# EAGLE design current-meter-nrf (EAGLE 6.3)
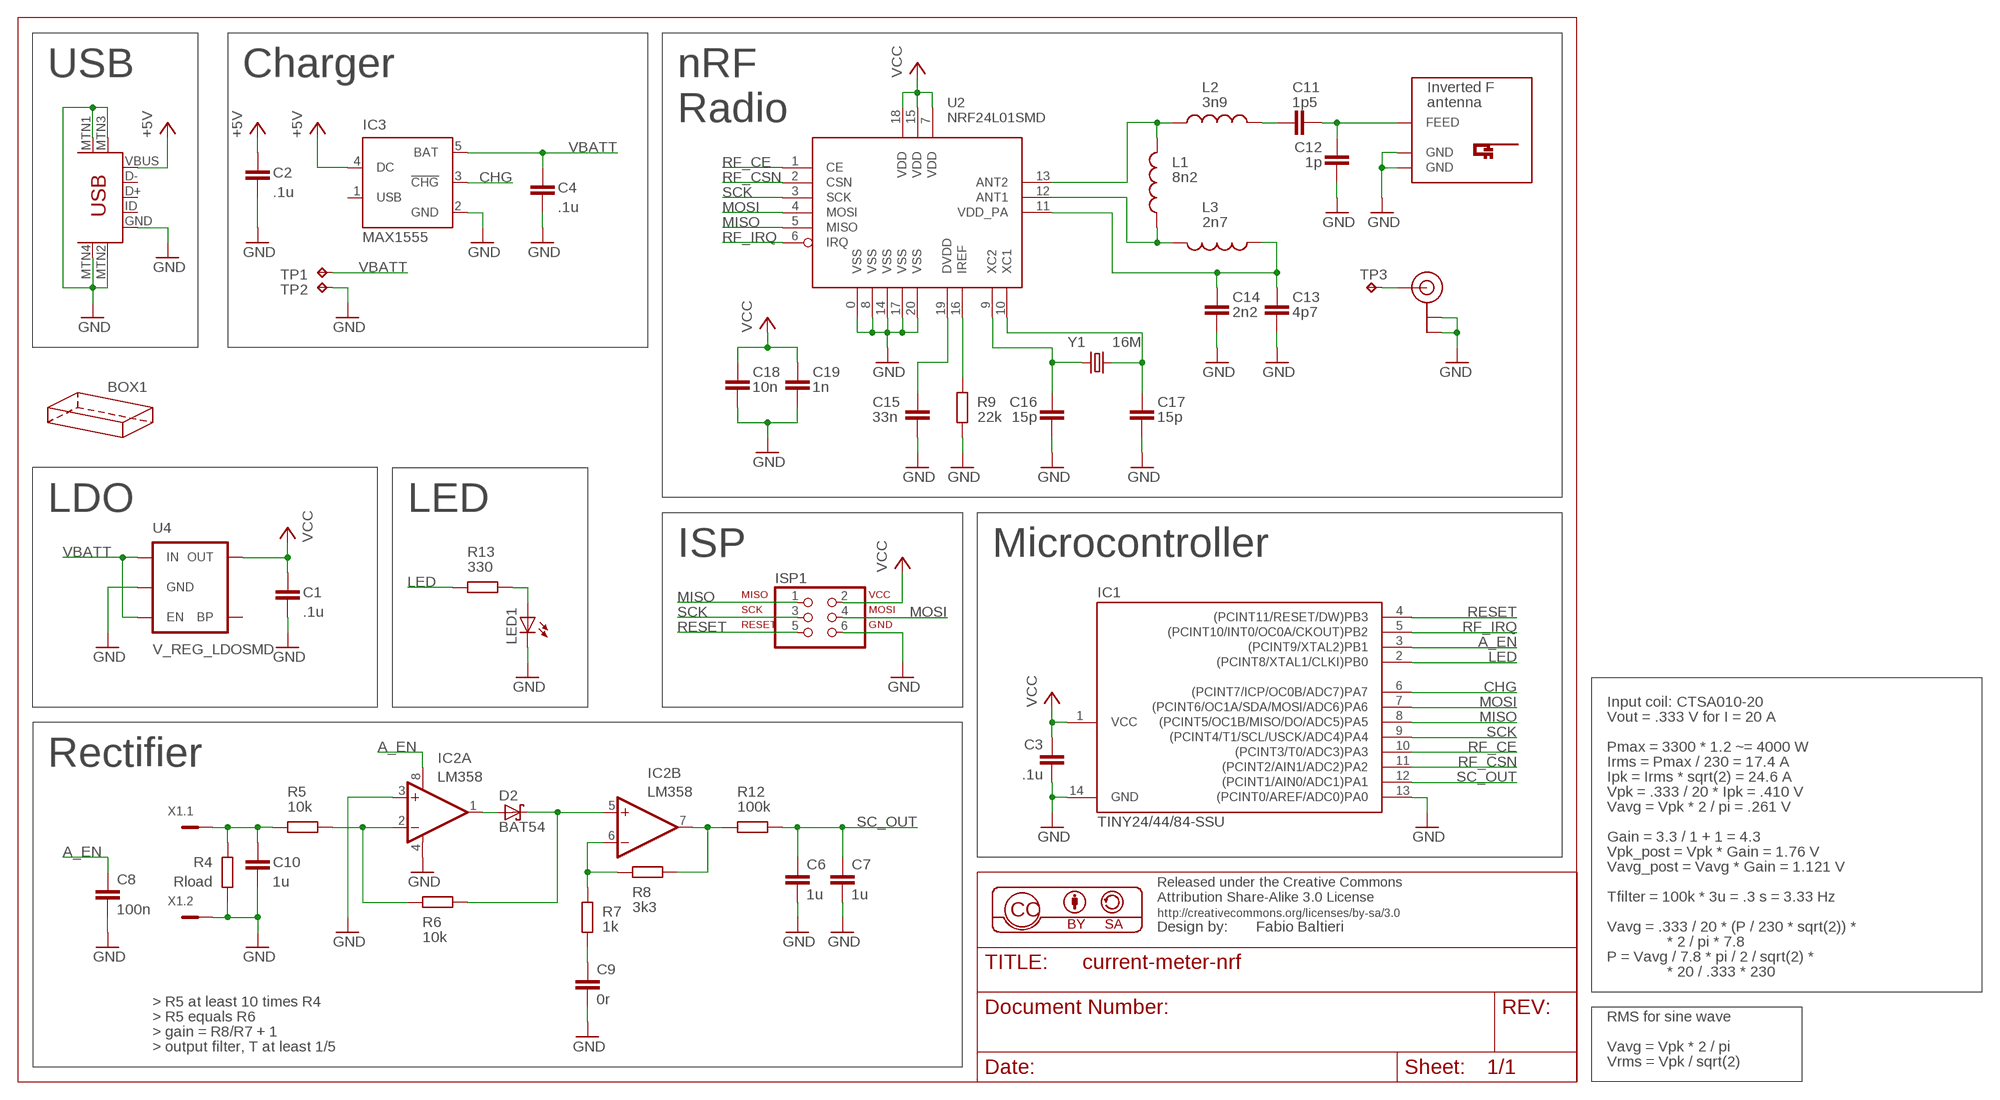
[diagram p0: schematic, sheet 1]

## Parts
BOX1  HAMMOND-BOX-G-1H  [1551G-1HOLE]
C1  .1u  C-EUC0805  [C0805]
C2  .1u  C-EUC0805  [C0805]
C3  .1u  C-EUC0805  [C0805]
C4  .1u  C-EUC0805  [C0805]
C6  1u  C-EUC0805  [C0805]
C7  1u  C-EUC0805  [C0805]
C8  100n  C-EUC0805  [C0805]
C9  0r  C-EUC0805  [C0805]
C10  1u  C-EUC0805  [C0805]
C11  1p5  C-EUC0603  [C0603]
C12  1p  C-EUC0603  [C0603]
C13  4p7  C-EUC0603  [C0603]
C14  2n2  C-EUC0603  [C0603]
C15  33n  C-EUC0603  [C0603]
C16  15p  C-EUC0603  [C0603]
C17  15p  C-EUC0603  [C0603]
C18  10n  C-EUC0603  [C0603]
C19  1n  C-EUC0603  [C0603]
D2  BAT54  [SOT23]
IC1  TINY24/44/84-SSU  [SOIC14]
IC2  LM358  OPA2234U  [SO08]
IC3  MAX1555  [SOT23-5L]
ISP1  ISP-AVR910PTH  [2X03]
L1  8n2  INDUCTOR0603  [0603]
L2  3n9  INDUCTOR0603  [0603]
L3  2n7  INDUCTOR0603  [0603]
LED1  LEDSML0805  [SML0805]
R4  Rload  R-EU_R0805  [R0805]
R5  10k  R-EU_R0603  [R0603]
R6  10k  R-EU_R0603  [R0603]
R7  1k  R-EU_R0603  [R0603]
R8  3k3  R-EU_R0603  [R0603]
R9  22k  R-EU_R0603  [R0603]
R12  100k  R-EU_R0603  [R0603]
R13  330  R-EU_R0603  [R0603]
TP1  TPTP12R  [TP12R]
TP2  TPTP12R  [TP12R]
TP3  TPTP08SQ  [TP08SQ]
U2  NRF24L01SMD  [QFN20]
U3  USB-MINIB-5PIN  [USB-MINIB]
U4  V_REG_LDOSMD  [SOT23-5]
U$1  INVERTED_F_ANTENNA+5  [DN007+5]
U$2  U.FL  [U.FL]
X1  MC2  [MC2]
Y1  16M  CRYSTAL5X3  [CRYSTAL-SMD-5X3]

## Nets
+5V: C2.1 IC3.4(DC) U3.VBUS
A_EN: C8.1 IC1.3((PCINT9/XTAL2)PB1) IC2.8(A:V+)
CHG: IC1.6((PCINT7/ICP/OC0B/ADC7)PA7) IC3.3(!CHG)
GND: C1.2 C2.2 C3.2 C4.2 C6.2 C7.2 C8.2 C9.2 C10.2 C12.2 C13.2 C14.2 C15.2 C16.2 C17.2 C18.2 C19.2 IC1.13((PCINT0/AREF/ADC0)PA0) IC1.14(GND) IC2.3(A:+IN) IC2.4(A:V-) IC3.2(GND) ISP1.6 LED1.C R4.1 R9.2 TP2.TP U2.0(VSS) U2.8(VSS) U2.14(VSS) U2.17(VSS) U2.20(VSS) U3.GND U3.MTN1(MTN2) U3.MTN2(MTN3) U3.MTN3(MTN1) U3.MTN4 U4.2(GND) U$1.GND U$1.GND@1(GND) U$2.P$1(GND) U$2.P$2(GND) X1.2
LED: IC1.2((PCINT8/XTAL1/CLKI)PB0) R13.2
MISO: IC1.8((PCINT5/OC1B/MISO/DO/ADC5)PA5) ISP1.1 U2.5(MISO)
MOSI: IC1.7((PCINT6/OC1A/SDA/MOSI/ADC6)PA6) ISP1.4 U2.4(MOSI)
N$3: LED1.A R13.1
N$4: C9.1 R7.1
N$5: L1.2 L3.2 U2.12(ANT1)
N$6: L1.1 L2.1 U2.13(ANT2)
N$7: IC2.2(A:-IN) R5.2 R6.1
N$8: D2.1(A) IC2.1(A:OUT)
N$9: D2.3(C) IC2.5(B:+IN) R6.2
N$10: C11.1 L2.2
N$11: IC2.6(B:-IN) R7.2 R8.1
N$12: IC2.7(B:OUT) R8.2 R12.1
N$13: C11.2 C12.1 U$1.FEED
N$14: C13.1 C14.1 L3.1 U2.11(VDD_PA)
N$15: C15.1 U2.19(DVDD)
N$16: R9.1 U2.16(IREF)
N$17: C17.1 U2.10(XC1) Y1.3
N$18: C16.1 U2.9(XC2) Y1.1
N$19: TP3.TP U$2.P$3(SIGNAL)
RESET: IC1.4((PCINT11/RESET/DW)PB3) ISP1.5
RF_CE: IC1.10((PCINT3/T0/ADC3)PA3) U2.1(CE)
RF_CSN: IC1.11((PCINT2/AIN1/ADC2)PA2) U2.2(CSN)
RF_IRQ: IC1.5((PCINT10/INT0/OC0A/CKOUT)PB2) U2.6(IRQ)
SC_IN_A: C10.1 R4.2 R5.1 X1.1
SC_OUT: C6.1 C7.1 IC1.12((PCINT1/AIN0/ADC1)PA1) R12.2
SCK: IC1.9((PCINT4/T1/SCL/USCK/ADC4)PA4) ISP1.3 U2.3(SCK)
VBATT: C4.1 IC3.5(BAT) TP1.TP U4.1(IN) U4.3(EN)
VCC: C1.1 C3.1 C18.1 C19.1 IC1.1(VCC) ISP1.2 U2.7(VDD) U2.15(VDD) U2.18(VDD) U4.5(OUT)
Unconnected: IC3.1(USB) U3.D+ U3.D- U3.ID U4.4(BP)

## Notes on the sheet
- USB | Charger | nRF
- Radio
- LDO | LED
- ISP | Microcontroller
- Input coil: CTSA010-20
- Vout = .333 V for I = 20 A
- Pmax = 3300 * 1.2 ~= 4000 W
- Rectifier | Irms = Pmax / 230 = 17.4 A
- Ipk = Irms * sqrt(2) = 24.6 A
- Vpk = .333 / 20 * Ipk = .410 V
- Vavg = Vpk * 2 / pi = .261 V
- Gain = 3.3 / 1 + 1 = 4.3
- Vpk_post = Vpk * Gain = 1.76 V
- Vavg_post = Vavg * Gain = 1.121 V
- Tfilter = 100k * 3u = .3 s = 3.33 Hz
- Vavg = .333 / 20 * (P / 230 * sqrt(2)) *
- * 2 / pi * 7.8
- P = Vavg / 7.8 * pi / 2 / sqrt(2) *
- * 20 / .333 * 230
- > R5 at least 10 times R4
- > R5 equals R6 | RMS for sine wave
- > gain = R8/R7 + 1
- > output filter, T at least 1/5 | Vavg = Vpk * 2 / pi
- Vrms = Vpk / sqrt(2)

## Library data of the parts
BOX1 = hammond:HAMMOND-BOX: Hammond Project boxes Hammond 1551 Transluscent Blue 50x35x20mm 1551GTBU http://www.hammondmfg.com/pdf/1551G.pdf Hammond 1551 Transluscent Blue 50x50x20mm 1551RTBU http://www.hammondmfg.com/pdf/1551R.pdf Hammond 1551 Transluscent Blue 60x35x20mm 1551HTBU http://www.hammondmfg.com/pdf/1551H.pdf Hammond 1551 Transluscent Blue 80x40x20mm 1551KTBU http://www.hammondmfg.com/pdf/1551K.pdf Hammond 1591 Transluscent Blue 100x51x22m m 1591XXATBU http://www.hammondmfg.com/pdf/1591XXA.pdf
C1-C4 C6-C19 = rcl:C-EU: CAPACITOR, European symbol
D2 = diode:BAT54: Schottky Diodes Source: Fairchild .. BAT54.pdf
IC1 = avr-5:TINY24/44/84
IC2 = burr-brown:OPA2234: Operational Amplifier; MF: TEXAS INSTRUMENTS; MPN: OPA2234U; OC_FARNELL: 1212441; OC_NEWARK: 96K4523
IC3 = maxim:MAX1555: Dual-Input USB/AC Adapter 1-Cell Li+ Battery Chargers Source: http://www.maxim-ic.com .. MAX1551-MAX1555.pdf
ISP1 = balto:ISP-AVR910: PIN HEADER
L1-L3 = SparkFun:INDUCTOR: Inductors Basic Inductor/Choke - 0603 and 1206. Footprints are not proven and vary greatly between part numbers.
LED1 = led:LED: LED OSRAM: - CHIPLED LG R971, LG N971, LY N971, LG Q971, LY Q971, LO R971, LY R971 LH N974, LH R974 LS Q976, LO Q976, LY Q976 LO Q996 - Hyper CHIPLED LW Q18S LB Q993, LB Q99A, LB R99A - SideLED LS A670, LO A670, LY A670, LG A670, LP A670 LB A673, LV A673, LT A673, LW A673 LH A674 LY A675 LS A676, LA A676, LO A676, LY A676, LW A676 LS A679, LY A679, LG A679 - Hyper Micro SIDELED® LS Y876, LA Y876, LO Y876, LY Y876 LT Y87S - SmartLED LW L88C, LW L88S LB L89C, LB L89S, LG L890 LS L89K, LO L89K, LY L89K LS L896, LA L896, LO L896, LY L896 - TOPLED LS T670, LO T670, LY T670, LG T670, LP T670 LSG T670, LSP T670, LSY T670, LOP T670, LYG T670 LG T671, LOG T671, LSG T671 LB T673, LV T673, LT T673, LW T673 LH T674 LS T676, LA T676, LO T676, LY T676, LB T676, LH T676, LSB T676, LW T676 LB T67C, LV T67C, LT T67C, LS T67K, LO T67K, LY T67K, LW E67C LS E67B, LA E67B, LO E67B, LY E67B, LB E67C, LV E67C, LT E67C LW T67C LS T679, LY T679, LG T679 LS T770, LO T770, LY T770, LG T770, LP T770 LB T773, LV T773, LT T773, LW T773 LH T774 LS E675, LA E675, LY E675, LS T675 LS T776, LA T776, LO T776, LY T776, LB T776 LHGB T686 LT T68C, LB T68C - Hyper Mini TOPLED® LB M676 - Mini TOPLED Santana® LG M470 LS M47K, LO M47K, LY M47K Source: http://www.osram.convergy.de LUXEON: - LUMILED® LXK2-PW12-R00, LXK2-PW12-S00, LXK2-PW14-U00, LXK2-PW14-V00 LXK2-PM12-R00, LXK2-PM12-S00, LXK2-PM14-U00 LXK2-PE12-Q00, LXK2-PE12-R00, LXK2-PE12-S00, LXK2-PE14-T00, LXK2-PE14-U00 LXK2-PB12-K00, LXK2-PB12-L00, LXK2-PB12-M00, LXK2-PB14-N00, LXK2-PB14-P00, LXK2-PB14-Q00 LXK2-PR12-L00, LXK2-PR12-M00, LXK2-PR14-Q00, LXK2-PR14-R00 LXK2-PD12-Q00, LXK2-PD12-R00, LXK2-PD12-S00 LXK2-PH12-R00, LXK2-PH12-S00 LXK2-PL12-P00, LXK2-PL12-Q00, LXK2-PL12-R00 Source: www.luxeon.com KINGBRIGHT: KA-3528ASYC Source: www.kingbright.com
R4-R9 R12 R13 = rcl:R-EU_: RESISTOR, European symbol
TP1-TP3 = testpad:TP: Test pad
U2 = SparkFun:NRF24L01: 2.4GHz Low Power Transceiver This is the very popular, low cost, very low power RF transceiver from Nordic Semiconductor. Simple SPI interface. SKU: COM-00690
U3 = SparkFun:USB-MINIB: Mini-USB "B" connector with 5th pin broken out. Created new symbol breaking out 5th "ID" pin in mini/micro USB connector spec. See: http://en.wikipedia.org/wiki/Mini_usb#Cables. Uses same footprint as 4-pin symbol. Also added pins to connect to mounting / shield pads if required (probably not generally needed as signals aren't shielded once they leave the connector).
U4 = SparkFun-PowerIC:V_REG_LDO: Voltage Regulator LDO Standard 150mA LDO voltage regulator in SOT-23 layout. Micrel part MIC5205. BP (by-pass) pin is used to lower output noise with 470pF cap.
U$1 = antenna:INVERTED_F_ANTENNA: 2.4GHz Inverted F Antenna Based on TI Design Note DN007
U$2 = SparkFun-Connectors:U.FL: SMD antenna connector- WRL-09144
X1 = con-phoenix-381_l:MC2: Mini-Combicon 3.81mm horizontal 2-polig MC 1,5/2-G-3,81 Artikel-Nr. 1803277
Y1 = SparkFun:CRYSTAL: Crystals Various standard crystals. Proven footprints. Spark Fun Electronics SKU : COM-00534

## Net classes
1 power: width 0.254 mm

## Board
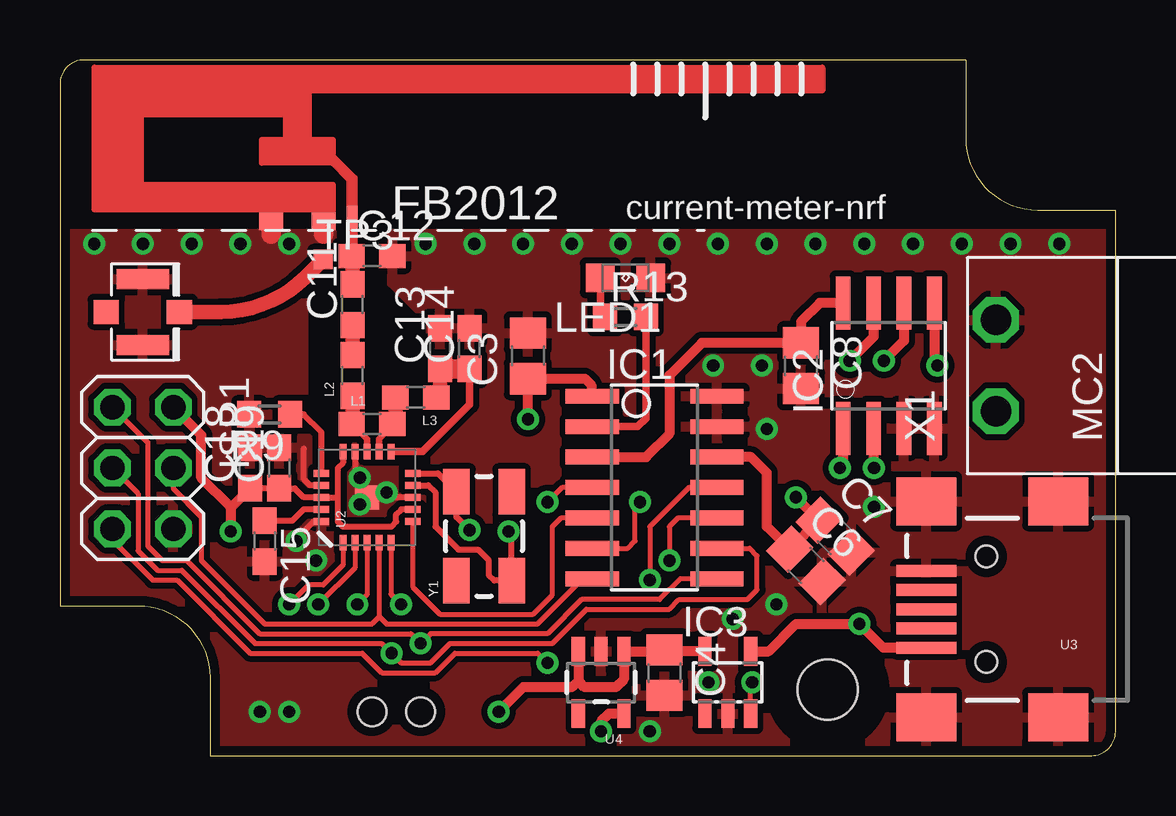
[diagram p1: board, top side]
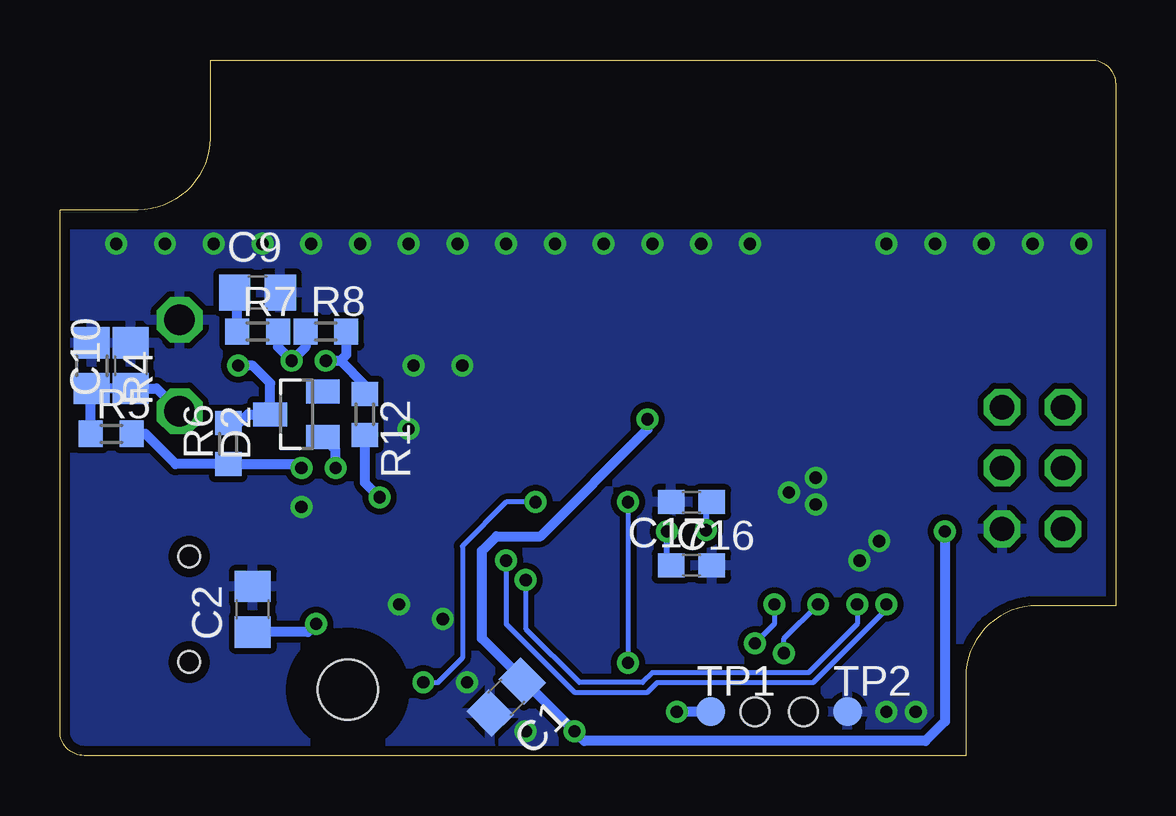
[diagram p2: board, bottom side, seen from below]

Size 44 x 29 mm. Coordinates in mm from the lower left corner, seen from the top.
Copper layers (1*16): Top 0.035mm / dielectric 1.5mm / Bottom 0.035mm
Design rules "default": minimum track width 8mil, minimum drill 20mil, track to track 8mil, track to pad 8mil, pad to pad 8mil, via to via 8mil, smd to smd 8mil, copper to edge 16mil, drill to drill 8mil, minimum pad ring 8mil, minimum via ring 8mil, stop-mask expansion 4mil, vias tented up to drill 20mil, thermal gap 10mil
Holes 1.2 mm at 13,1.83 15.04,1.83

### Footprints (pad centres in the part's own frame; a part is rotated, then mirrored left to right if it is on the bottom)
1551G-1HOLE = hole 2.5: 12,26.25
C0805 = smd 1.3 x 1.5: 1 -0.95,0; 2 0.95,0
C0603 = smd 1.1 x 1: 1 -0.85,0; 2 0.85,0
SOT23 = smd 1 x 1.4: 1 -0.95,-1.1; 2 0.95,-1.1; 3 0,1.1
SOIC14 = smd 0.61 x 2.21: 1 -3.81,-2.603; 2 -2.54,-2.603; 3 -1.27,-2.603; 4 0,-2.603; 5 1.27,-2.603; 6 2.54,-2.603; 7 3.81,-2.603; 8 3.81,2.603; 9 2.54,2.603; 10 1.27,2.603; 11 0,2.603; 12 -1.27,2.603; 13 -2.54,2.603; 14 -3.81,2.603
SO08 = smd 0.61 x 2.21: 1 -1.905,-2.616; 2 -0.635,-2.616; 3 0.635,-2.616; 4 1.905,-2.616; 5 1.905,2.616; 6 0.635,2.616; 7 -0.635,2.616; 8 -1.905,2.616
SOT23-5L = smd 0.55 x 1.2: 1 -0.95,-1.3; 2 0,-1.3; 3 0.95,-1.3; 4 0.95,1.3; 5 -0.95,1.3
2X03 = drill 1.016 octagon: 1 -2.54,-1.27; 2 -2.54,1.27; 3 0,-1.27; 4 0,1.27; 5 2.54,-1.27; 6 2.54,1.27
0603 = smd 1.1 x 1: 1 -0.85,0; 2 0.85,0
SML0805 = smd 1.2 x 1.2: A 1.05,0; C -1.05,0
R0805 = smd 1.3 x 1.5: 1 -0.95,0; 2 0.95,0
R0603 = smd 1 x 1.1: 1 -0.85,0; 2 0.85,0
TP12R = smd 1.2 x 1.2: TP 0,0
TP08SQ = smd 0.8 x 0.8: TP 0,0
QFN20 = smd 1 x 1: 0 0,0 | smd 0.65 x 0.29: 1 -1.9,1; 2 -1.9,0.5; 3 -1.9,0; 4 -1.9,-0.5; 5 -1.9,-1; 11 1.9,-1; 12 1.9,-0.5; 13 1.9,0; 14 1.9,0.5; 15 1.9,1 | smd 0.29 x 0.65: 6 -1,-1.9; 7 -0.5,-1.9; 8 0,-1.9; 9 0.5,-1.9; 10 1,-1.9; 16 1,1.9; 17 0.5,1.9; 18 0,1.9; 19 -0.5,1.9; 20 -1,1.9
USB-MINIB = smd 2.5 x 0.5: D+ 2.5,0; D- 2.5,0.8; GND 2.5,-1.6; ID 2.5,-0.8; VBUS 2.5,1.6 | smd 2.5 x 2: MTN1 -3,4.5; MTN2 2.5,4.5; MTN3 -3,-4.5; MTN4 2.5,-4.5 | hole 0.9: 0,2.2; 0,-2.2
SOT23-5 = smd 0.55 x 1.2: 1 -0.95,-1.3; 2 0,-1.3; 3 0.95,-1.3; 4 0.95,1.3; 5 -0.95,1.3
DN007+5 = smd 0.46 x 1: FEED 2.22,-2.8 | smd 1.01 x 0.74: GND -1.16,-2.93; GND@1 1.035,-2.93
U.FL = smd 2.2 x 0.85: P$1 0,1.375; P$2 0,-1.375 | smd 1.05 x 1: P$3 1.525,0; P$4 -1.525,0
MC2 = drill 1.27 octagon: 1 -1.905,0; 2 1.905,0
CRYSTAL-SMD-5X3 = smd 1.9 x 1.1: 1 -1.85,-1.15; 2 1.85,-1.15; 3 1.85,1.15; 4 -1.85,1.15

### Placement (x,y rotation side)
BOX1  44,29 180 top
C1  25.4,2.44 225 bottom
C2  35.97,6.1 90 bottom
C3  19.51,16.66 90 top
C4  25.2,3.45 270 top
C6  31.09,7.92 315 top
C7  32.31,9.14 315 top
C8  30.89,16.26 270 top
C9  35.76,19.3 0 bottom
C10  41.05,16.26 90 bottom
C11  12.19,18.8 90 top
C12  13,20.83 0 top
C13  15.85,16.97 90 top
C14  17.07,16.97 90 top
C15  8.53,8.94 270 top
C16  17.68,7.92 0 bottom
C17  17.68,10.57 180 bottom
C18  7.92,11.99 90 top
C19  9.14,11.99 90 top
D2  34.14,14.22 90 bottom
IC1  24.79,11.18 270 top
IC2  34.54,16.26 0 top
IC3  27.84,3.05 0 top
ISP1  3.45,11.99 270 top
L1  13,13.82 0 top
L2  12.19,15.85 90 top
L3  14.83,14.94 180 top
LED1  23.57,19.91 180 top
R4  42.67,16.26 270 bottom
R5  41.86,13.41 0 bottom
R6  36.98,13 90 bottom
R7  35.76,17.68 0 bottom
R8  32.92,17.68 0 bottom
R9  8.74,14.22 180 top
R12  31.29,14.22 270 bottom
R13  23.57,18.29 0 top
TP1  16.87,1.83 0 bottom
TP2  11.18,1.83 0 bottom
TP3  10.97,20.69 0 top
U2  12.8,10.77 90 top
U3  38.61,6.1 180 top
U4  22.56,3.05 180 top
U$1  9.96,25.2 0 top
U$2  3.45,18.49 0 top
X1  39.01,16.26 90 top
Y1  17.68,9.14 90 top

### Tracks (layer width: path | path; a pad name or v marks a point on that pad's centre or on a via)
+5V  (via drill 0.51)
  Top 0.406: U3.VBUS 34.31,4.5 v33.33,5.49 30.68,5.49 29.55,4.35 IC3.4
  Bottom 0.406: v33.33,5.49 33.66,5.15 C2.1
A_EN
  Top 0.406: IC2.8 31.67,18.87 30.89,18.09 C8.1 26.76,17.21 25.4,15.85 25.4,13.41 24.43,12.45 IC1.3
CHG  (via drill 0.51)
  Top 0.203: IC3.3 28.79,2.98 v28.85,3.05 | IC1.6 23.67,8.64 23.98,8.94 23.98,10.36 v24.18,10.57
  Bottom 0.203: v24.18,10.57 25.4,10.57 27.23,8.74 27.23,4.06 28.25,3.05 v28.85,3.05
GND  (via drill 0.51)
  Top 0.254: U2.14 12.3,11.79 | U2.8 13.61,10.77 | U2.17 10.42,11.27 10.16,11.53 10.16,12.8 | U2.20 10.58,9.77 9.96,9.14
  Top 0.813: U$1.GND 8.8,21.74 | U$1.GND@1 10.99,21.74
  other vias: 17.27,21.34 15.24,21.34 19.3,21.34 21.34,21.34 23.37,21.34 25.4,21.34 27.43,21.34 29.46,21.34 31.5,21.34 33.53,21.34 35.56,21.34 37.59,21.34 39.62,21.34 41.66,21.34 7.52,21.34 5.49,21.34 3.45,21.34 1.42,21.34 12.5,10.46 12.5,11.58 13.61,10.97 9.55,21.34 9.86,8.94 10.67,8.13 27.23,16.26 29.26,16.26 29.46,13.61 29.87,6.3 33.93,10.36 28.04,5.69 8.33,1.83 9.55,1.83 27.03,3.05 24.59,1.02
  pour Top (isolate 0.254): 0,0 44.09,0 44.09,21.74 13.82,21.74 13.82,19.71 15.44,18.08 15.44,13.41 10.16,13.41 10.16,21.13 11.38,21.13 11.38,21.74 0,21.74
  pour Bottom (isolate 0.254): 0,0 44.09,0 44.09,21.74 0,21.74
  pour Top (isolate 0.254, no thermals): 11.99,9.96 13.41,9.96 13.82,10.36 13.82,11.79 12.19,11.79 11.99,11.58
LED
  Top 0.305: IC1.2 24.08,13.72 24.42,14.06 R13.2
MISO  (via drill 0.51)
  Top 0.203: ISP1.1 3.66,13.06 3.66,8.74 4.27,8.13 5.28,8.13 8.33,5.08 14.63,5.08 v15.04,4.67 15.44,5.08 20.32,5.08 21.74,6.5 24.99,6.5 25.86,7.37 IC1.8 | U2.5 13.8,6.72 v14.22,6.3
  Bottom 0.203: v14.22,6.3 14.22,5.49 v15.04,4.67
MOSI
  Top 0.203: ISP1.4 4.72,11.12 5.89,9.96 5.89,8.13 8.53,5.49 13.01,5.49 13.3,5.78 | U2.4 13.3,5.78 | 13.3,5.78 13.32,5.78 13.61,5.49 19.9,5.49 21.78,7.37 IC1.7
N$3
  Top 0.305: R13.1 22.52,18.49 LED1.A
N$4
  Bottom 0.406: R7.1 36.61,19.2 C9.1
N$5
  Top 0.279: U2.12 13.3,13.21 13.86,13.76 L1.2
  Top 0.61: L3.2 13.98,13.95 L1.2
N$6
  Top 0.279: U2.13 12.8,13.21 12.19,13.82 L1.1
  Top 0.61: L2.1 12.19,13.86 L1.1
N$7  (via drill 0.51)
  Top 0.406: IC2.2 33.91,12.01 v33.93,11.99
  Bottom 0.406: R5.2 40.44,13.41 39.18,12.15 R6.1 34.1,12.15 v33.93,11.99
N$8  (via drill 0.51)
  Top 0.406: IC2.1 32.64,12.12 v32.51,11.99
  Bottom 0.406: v32.51,11.99 32.51,12.75 D2.1
N$9  (via drill 0.51)
  Top 0.406: IC2.5 36.45,16.38 v36.58,16.26
  Bottom 0.406: R6.2 36.54,13.86 36.17,14.22 D2.3 35.24,15.53 35.97,16.26 v36.58,16.26
N$10
  Top 0.61: C11.1 L2.2
N$11  (via drill 0.51)
  Top 0.406: IC2.6 35.18,17.3 v34.34,16.46
  Bottom 0.406: R8.1 33.77,17.03 v34.34,16.46 34.91,17.03 R7.2
N$12  (via drill 0.51)
  Top 0.406: IC2.7 33.91,17.45 v32.92,16.46
  Bottom 0.406: v32.92,16.46 32.31,16.46 | 32.31,16.46 32.07,16.7 R8.2 | 32.31,16.46 31.29,15.44 R12.1
N$13
  Top 0.46: U$1.FEED 12.18,20.85 C12.1
  Top 0.61: C11.2 12.19,20.79 C12.1
N$14
  Top 0.305: U2.11 15.11,12.67 17.07,14.63 C14.1
  Top 0.61: C13.1 15.85,15.1 L3.1
  Top 0.813: C14.1 C13.1
N$15
  Top 0.254: U2.19 10.16,10.27 9.68,9.79 C15.1
N$16
  Top 0.254: U2.16 10.9,13.48 10.16,14.22 R9.1
N$17  (via drill 0.51)
  Top 0.254: U2.10 15.75,11.77 Y1.3 16.53,9.94 v17.07,9.4
  Bottom 0.254: C17.1 17.07,10.33 v17.07,9.4
N$18  (via drill 0.51)
  Top 0.254: U2.9 15.35,11.27 15.65,10.97 15.65,9.55 16.61,8.59 17.42,8.59 17.88,8.13 17.88,7.52 18.11,7.29 Y1.1 18.83,9.21 v18.69,9.35
  Bottom 0.254: C16.1 18.69,8.09 v18.69,9.35
N$19
  Top 0.61: U$2.P$3 6.7,18.49 arc45 10.23,19.96 TP3.TP
RESET  (via drill 0.51)
  Top 0.203: ISP1.5 2.18,8.99 3.86,7.32 4.88,7.32 7.92,4.27 12.6,4.27 13.41,3.45 15.65,3.45 16.46,4.27 19.91,4.27 v20.32,3.86 | IC1.4 20.93,11.18 v20.32,10.57
  Bottom 0.203: v20.32,10.57 v20.32,3.86
RF_CE  (via drill 0.51)
  Top 0.203: U2.1 11.8,7.94 10.97,7.11 10.36,7.11 v9.55,6.3 | IC1.10 25.76,9.91 25.4,9.55 v25.4,8.13
  Bottom 0.203: v25.4,8.13 25.4,5.49 22.55,2.64 19.51,2.64 19.1,3.05 12.6,3.05 9.55,6.1 v9.55,6.3
RF_CSN  (via drill 0.51)
  Top 0.203: U2.2 12.3,7.83 v10.77,6.3 | IC1.11 26.21,11.18 24.59,9.55 v24.59,7.32
  Bottom 0.203: v24.59,7.32 24.59,5.28 22.35,3.05 19.71,3.05 19.3,3.45 12.8,3.45 10.77,5.49 v10.77,6.3
RF_IRQ
  Top 0.203: U2.6 14.7,7.04 15.85,5.89 19.71,5.89 20.52,6.71 20.52,9.55 20.88,9.91 IC1.5
SC_IN_A
  Bottom 0.406: X1.1 39.97,15.31 C10.1 R4.2 42.71,15.27 R5.1
SC_OUT  (via drill 0.51)
  Top 0.406: IC1.12 28.8,12.45 29.46,11.79 29.46,9.55 C6.1 C7.1 v30.68,10.77 | v30.68,10.77
  Bottom 0.406: R12.2 31.29,11.38 v30.68,10.77
SCK  (via drill 0.51)
  Top 0.203: ISP1.3 3.25,10.92 3.25,8.53 4.06,7.72 5.08,7.72 8.13,4.67 13.41,4.67 v13.82,4.27 14.22,3.86 15.44,3.86 16.26,4.67 20.52,4.67 21.95,6.1 25.4,6.1 25.81,6.5 28.65,6.5 29.06,6.91 29.06,8.33 28.75,8.64 IC1.9 | U2.3 12.8,6.71 v12.39,6.3
  Bottom 0.203: v13.82,4.27 13.82,4.88 v12.39,6.3
VBATT  (via drill 0.51)
  Top 0.406: v18.29,1.83 19.3,2.85 21.34,2.85 21.61,3.11 | U4.3 21.61,3.11 | 21.61,3.11 21.87,2.85 23.16,2.85 23.5,3.19 U4.1 25.14,4.35 C4.1 25.25,4.35 IC3.5
  Bottom 0.406: TP1.TP v18.29,1.83
VCC  (via drill 0.51)
  Top 0.254: U2.15 11.8,12.21 11.58,11.99 11.58,10.77 | 11.58,10.77 11.58,9.75 11.79,9.55 13.82,9.55 14.02,9.75 14.02,10.06 14.23,10.27 U2.7 | 11.58,10.77 U2.18 10.16,10.77 9.79,11.14 C19.1 C18.1
  Top 0.406: C18.1 7.11,10.33 | 7.11,10.33 v7.11,9.35 | 7.11,10.33 7.11,10.36 5.89,11.58 5.89,13.36 ISP1.2 | v19.51,14.02 C3.1 21.88,15.71 22.15,15.44 22.15,15.02 IC1.1 | U4.5 22.88,1.75 22.55,1.42 v22.55,1.02
  Bottom 0.406: v7.11,9.35 7.11,1.42 7.92,0.61 22.15,0.61 v22.55,1.02 24.65,3.11 C1.1 24.73,3.19 26.42,4.88 26.42,8.53 25.81,9.14 23.98,9.14 19.51,13.61 v19.51,14.02

### Text on the board
_tsilk: FB2012 | current-meter-nrf